# Altium project mega48.PrjPcb
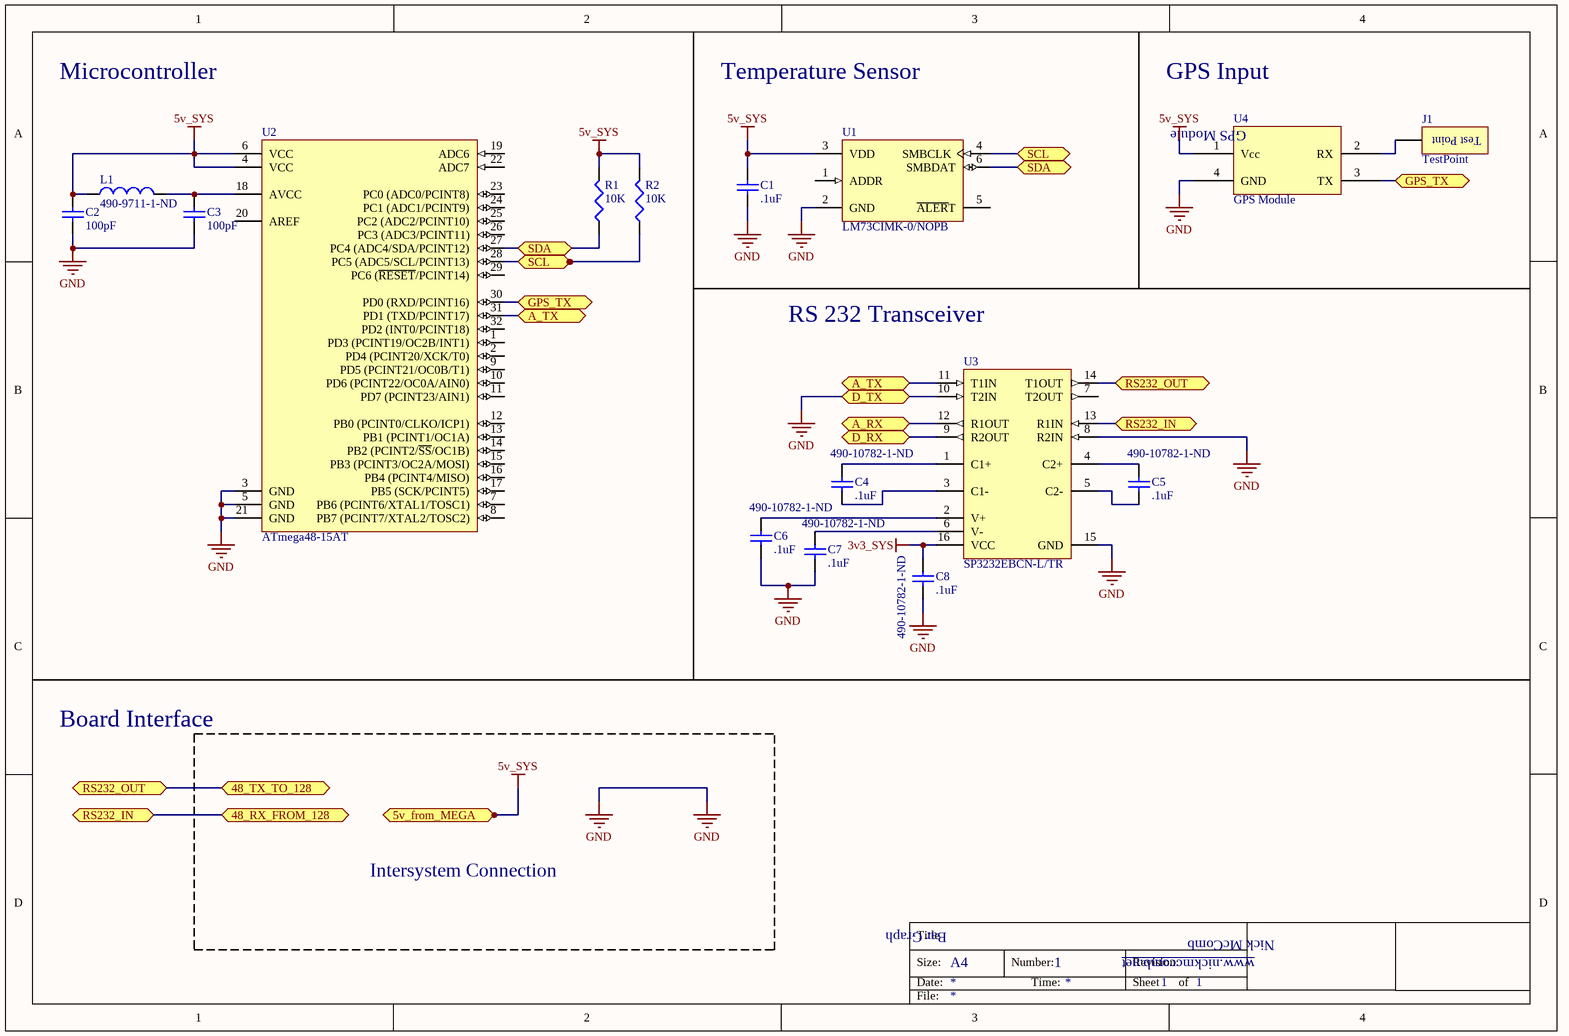
[diagram p0: uC.SchDoc]
1 sheet, 16 parts. Net scope: flat (ports and power ports of the same name join across sheets).

## Sheet uC.SchDoc
size A4; Organization: Altium Limited; Address1: L3, 12a Rodborough Rd; Address2: Frenchs Forest; Address3: NSW; Address4: Australia 2086; DocumentNumber: 1; SheetNumber: 1; SheetTotal: 1

### Parts
C1  value .1uF  [C0805]  (hidden comment: 0805 style, by default)
C2  value 100pF  [C0805]  (hidden comment: 0805 style, by default)
C3  value 100pF  [C0805]  (hidden comment: 0805 style, by default)
C4  value .1uF  Supplier Part Number 1: 490-10782-1-ND  [C0805]  (hidden comment: 0805 style, by default)
C5  value .1uF  Supplier Part Number 1: 490-10782-1-ND  [C0805]  (hidden comment: 0805 style, by default)
C6  value .1uF  Supplier Part Number 1: 490-10782-1-ND  [C0805]  (hidden comment: 0805 style, by default)
C7  value .1uF  Supplier Part Number 1: 490-10782-1-ND  [C0805]  (hidden comment: 0805 style, by default)
C8  value .1uF  Supplier Part Number 1: 490-10782-1-ND  [C0805]  (hidden comment: 0805 style, by default)
J1  TestPoint  [TEST POINT]
L1  Supplier Part Number 1: 490-9711-1-ND  [L0805]
R1  10K  [J1-0603]
R2  10K  [J1-0603]
U1  LM73CIMK-0/NOPB  [DDC0006A_M]
U2  ATmega48-15AT  [32MA_N]
U3  SP3232EBCN-L/TR  [EXAR-NSOIC-16_N]
U4  GPS Module

### Ports
5v_from_MEGA, 48_RX_FROM_128, 48_TX_TO_128, A_RX, A_TX, D_RX, D_TX, GPS_TX, RS232_IN, RS232_OUT, SCL, SDA

### Nets
3v3_SYS: C8.2 U3.16(VCC)
5v_SYS: C1.2 C2.2 L1.1 R1.2 R2.2 U1.3(VDD) U2.4(VCC) U2.6(VCC) U4.1(Vcc) ; port 5v_from_MEGA
GND: C1.1 C2.1 C3.1 C6.1 C7.1 C8.1 U1.2(GND) U2.3(GND) U2.5(GND) U2.21(GND) U3.8(R2IN) U3.10(T2IN) U3.15(GND) U4.4(GND) ; port D_TX
NetC3_2: C3.2 L1.2 U2.18(AVCC)
NetC4_1: C4.1 U3.3(C1-)
NetC4_2: C4.2 U3.1(C1+)
NetC5_1: C5.1 U3.5(C2-)
NetC5_2: C5.2 U3.4(C2+)
NetC6_2: C6.2 U3.2(V+)
NetC7_2: C7.2 U3.6(V-)
NetJ1_1: J1.1 U4.2(RX)
NetR1_1: R1.1 U1.6(SMBDAT) U2.27(PC4_(ADC4/SDA/PCINT12)) ; port SDA
NetR2_1: R2.1 U1.4(SMBCLK) U2.28(PC5_(ADC5/SCL/PCINT13)) ; port SCL
NetU2_30: U2.30(PD0_(RXD/PCINT16)) U4.3(TX) ; port GPS_TX
NetU2_31: U2.31(PD1_(TXD/PCINT17)) U3.11(T1IN) ; port A_TX
NetU3_9: U3.9(R2OUT) ; port D_RX
NetU3_12: U3.12(R1OUT) ; port A_RX
NetU3_13: U3.13(R1IN) ; port RS232_IN, port 48_RX_FROM_128
NetU3_14: U3.14(T1OUT) ; port RS232_OUT, port 48_TX_TO_128

Not connected (* = marked no-connect by the designer): U1 1(ADDR) 5(~{ALER}T); U2 1(PD3_(PCINT19/OC2B/INT1)) 2(PD4_(PCINT20/XCK/T0)) 7(PB6_(PCINT6/XTAL1/TOSC1)) 8(PB7_(PCINT7/XTAL2/TOSC2)) 9(PD5_(PCINT21/OC0B/T1)) 10(PD6_(PCINT22/OC0A/AIN0)) 11(PD7_(PCINT23/AIN1)) 12(PB0_(PCINT0/CLKO/ICP1)) 13(PB1_(PCINT1/OC1A)) 14(PB2_(PCINT2/~{SS}/OC1B)) 15(PB3_(PCINT3/OC2A/MOSI)) 16(PB4_(PCINT4/MISO)) 17(PB5_(SCK/PCINT5)) 19(ADC6) 20(AREF) 22(ADC7) 23(PC0_(ADC0/PCINT8)) 24(PC1_(ADC1/PCINT9)) 25(PC2_(ADC2/PCINT10)) 26(PC3_(ADC3/PCINT11)) 29(PC6_(~{RESET}/PCINT14)) 32(PD2_(INT0/PCINT18)); U3 7(T2OUT)

### Notes on the sheet
- Microcontroller
- Temperature Sensor
- GPS Input
- RS 232 Transceiver
- Board Interface
- Intersystem Connection
- Bar Graph
- Title
- Size:
- Date:
- A4
- Number:
- Time:
- Revision:
- Sheet
- of
- www.nickmccomb.net
- Nick McComb
- File:
- (in symbol TestPoint) Test Point

### Library data of the parts
C1-C3 = Cap: Capacitor; Published: 8-Jun-2000; LatestRevisionDate: 17-Jul-2002; LatestRevisionNote: Re-released for DXP Platform.; PackageReference: RAD-0.3; Publisher: Altium Limited; PackageDescription: Radial Cap, Thru-Hole; 2 Leads; 0.3 in Pin Spacing
C4-C8 = Cap: Capacitor; Manufacturer: Murata Electronics North America; Manufacturer Part Number: GRM21BR71H104JA01L; Capacitance: 0.10µF; Tolerance: ±5%; Voltage - Rated: 50V; Temperature Coefficient: X7R; Published: 8-Jun-2000; LatestRevisionDate: 17-Jul-2002; LatestRevisionNote: Re-released for DXP Platform.; PackageReference: RAD-0.3; Publisher: Altium Limited; PackageDescription: Radial Cap, Thru-Hole; 2 Leads; 0.3 in Pin Spacing; Supplier 1: Digi-Key; RoHS: RoHS Compliant; Category: Capacitors; Stock 1: 17503; Pricing 1: 1=0.16, 10=0.113, 50=0.065, 100=0.0537, 250=0.0452, 500=0.03786, 1000=0.03108 (USD); Packaging: Cut Tape (CT); Mounting Type: Surface Mount, MLCC; Operating Temperature: -55°C ~ 125°C; Applications: General Purpose; Ratings: -; Package / Case: 0805 (2012 Metric); Size / Dimension: 0.079" L x 0.049" W (2.00mm x 1.25mm); Height - Seated (Max): -; Thickness (Max): 0.053" (1.35mm); Lead Spacing: -; Features: -; Lead Style: -; ComponentLink1URL: http://www.murata.com/~/media/webrenewal/support/library/catalog/products/capacitor/mlcc/c02e.pdf; ComponentLink1Description: http://www.murata.com/~/media/webrenewal/support/library/catalog/products/capacitor/mlcc/c02e.pdf
L1 = Ferrite Bead: Murata Ferrite Bead; Manufacturer Part Number: BLM21RK102SN1D; Impedance: 1; Resistance: 500; Tolerance: 25; Current Rating: 200; Supplier 1: Digikey; Manufacturer: Murata; Stock 1: 16880; Pricing 1: 1=0.16, 10=0.135, 50=0.0868, 100=0.0748, 250=0.0598, 500=0.0539, 1000=0.0449 (USD); Mount: Surface Mount; Case/Package: 0805; Case Code (Metric): 2012; Case Code (Imperial): 0805; Min Operating Temperature: -55; Max Operating Temperature: 125; Core Material: Ferrite; Package Quantity: 4000; Packaging: Tape and Reel; Length: 0.079; Height: 0.85; Width: 0.049; Radiation Hardening: No; REACH SVHC: No SVHC; ComponentLink1URL: https://datasheet.ciiva.com/11800/0900766b811b5866-11800834.pdf; ComponentLink1Description: https://datasheet.ciiva.com/11800/0900766b811b5866-11800834.pdf; ComponentLink2URL: https://datasheet.ciiva.com/41449/001171743-da-01-en-chip-drossel0805-1000r-200ma-2-0x1-25mm-41449396.pdf; ComponentLink2Description: https://datasheet.ciiva.com/41449/001171743-da-01-en-chip-drossel0805-1000r-200ma-2-0x1-25mm-41449396.pdf; ComponentLink3URL: https://datasheet.ciiva.com/41449/001172370-da-01-en-drossel-0805-1000r-2-0x1-25mm-4000st-41449540.pdf; ComponentLink3Description: https://datasheet.ciiva.com/41449/001172370-da-01-en-drossel-0805-1000r-2-0x1-25mm-4000st-41449540.pdf; ComponentLink4URL: https://datasheet.ciiva.com/8021/5163-8021605.pdf; ComponentLink4Description: https://datasheet.ciiva.com/8021/5163-8021605.pdf; ComponentLink5URL: https://datasheet.ciiva.com/8021/5163-8021606.pdf; ComponentLink5Description: https://datasheet.ciiva.com/8021/5163-8021606.pdf; ComponentLink6URL: https://datasheet.ciiva.com/6211/l0110e-6211752.pdf; ComponentLink6Description: https://datasheet.ciiva.com/6211/l0110e-6211752.pdf; ComponentLink7URL: https://datasheet.ciiva.com/3082/l0110s0100blm21r-3082750.pdf; ComponentLink7Description: https://datasheet.ciiva.com/3082/l0110s0100blm21r-3082750.pdf; ComponentLink8URL: https://datasheet.ciiva.com/3081/l0110s0100blm21r-3081663.pdf; ComponentLink8Description: https://datasheet.ciiva.com/3081/l0110s0100blm21r-3081663.pdf
R1 R2 = Res3: Resistor; Published: 8-Jun-2000; LatestRevisionDate: 29-May-2009; LatestRevisionNote: IPC-7351 Footprint Added.; PackageReference: J1-0603; Publisher: Altium Limited; PackageDescription: Chip Resistor; Value: 10K
U1 = CMP-0066-00221-3: 2.7V, 11- to 14- Bit Digital Temperature Sensor with 2-Wire Interface, 6-pin Tiny SOT23, Pb-Free; Manufacturer: Texas Instruments; PackageTopMarking: T730*XTT; PowerWise: Y; CompType: Temp Sensor IC; PackageDescription: Molded TSOT, 2.97 x 1.65 x 0.87mm Body, 6 Lead, 0.95mm Pitch; ComponentLink1Description: Datasheet URL; ComponentLink1URL: http://www.ti.com/general/docs/lit/getliterature.tsp?genericPartNumber=LM73&fileType=pdf; Code_IPC: SOT26A-6; RoHS: Y; PinCount: 6; Code_JEDEC: MO-193-AA; PackageReference: DDC0006A
U2 = CMP-0096-00146-2: 8-bit Automotive AVR Microcontroller, 4KB Flash, 256 Bytes EEPROM, 512 Bytes SRAM, Automotive Grade (-40°C to +85°C), 32-Pin TQFP; ComponentLink1URL: http://www.atmel.com/; RevisionNote: URLs added; ComponentLink1Description: Manufacturer URL; PackageReference: 32MA; ComponentLink2URL: http://www.atmel.com/dyn/resources/prod_documents/doc7530.pdf; PackageDescription: 32-Lead Thin Profile Plastic Quad Flatpack (TQFP) - 7x7x1mm Body,  0.8 mm Pitch; ComponentLink2Description: ATmega48/88/168 Datasheet; DatasheetVersion: revI, Feb-2010; PackageVersion: revB, Jul-2007
U3 = CMP-0935-00001-1: RS-232 Transceiver with 2-Drivers / 2-Receivers, 3 to 5.5 V, 250 Kbps, 16-Pin NSOIC, 0 to 70 degC, Pb-free, Tape and Reel; Manufacturer: Exar Corporation; No. of Tx: 2; ESD: 15 KV; ComponentLink1URL: http://www.exar.com/; ComponentLink1Description: Manufacturer URL; PackageDescription: 16-Pin Small Outline Integrated Circuit, Body 9.9 x 3.9 mm, Pitch 1.27 mm; Data Rate: 250 Kbps; No. of Rx: 2; DatasheetVersion: Rev. 1.0.2; Packing: Tape and Reel; PartNumber: SP3232EBCN-L/TR; Temp. Range: 0 to 70 degC; VCC: 3 to 5.5 V; ComponentLink2Description: Datasheet; PackageReference: NSOIC-16; Mounting Technology: Surface Mount; ComponentLink2URL: https://www.exar.com/common/content/document.ashx?id=632&languageid=1033